# Altium project eBox_relay.PrjPcb
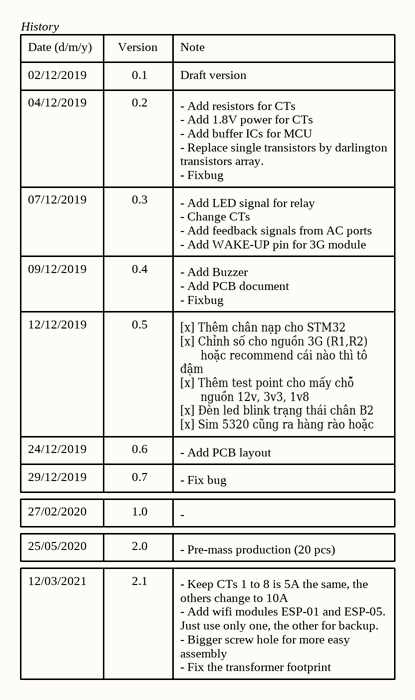
[diagram p0: eBox_Notes.SchDoc]
Hash: JD3SRPCM; Version: 3.0
2 sheets, 37 parts. Net scope: global (net labels, ports and power ports of the same name join across sheets).
Board file: eBox_relay.PcbDoc
Sheets:
  eBox_Notes.SchDoc
  eBox_relay.SchDoc

## Sheet eBox_Notes.SchDoc: eBox_Notes
size A4; DocumentNumber: 1; SheetNumber: 1; SheetTotal: 9

### Notes on the sheet
- History
- Date (d/m/y)
- 02/12/2019
- Version
- 0.1
- Note
- Draft version
- 04/12/2019
- 0.2
- 07/12/2019
- 0.3
- - Add resistors for CTs
  - Add 1.8V power for CTs
  - Add buffer ICs for MCU
  - Replace single transistors by darlington  transistors array.
  - Fixbug
- 09/12/2019
- 0.4
- - Add LED signal for relay
  - Change CTs
  - Add feedback signals from AC ports
  - Add WAKE-UP pin for 3G module
- 12/12/2019
- 0.5
- - Add Buzzer
  - Add PCB document
  - Fixbug
- [x] Thêm chân nạp cho STM32
  [x] Chỉnh số cho nguồn 3G (R1,R2)
  hoặc recommend cái nào thì tô đậm
  [x] Thêm test point cho mấy chỗ
  nguồn 12v, 3v3, 1v8
  [x] Đèn led blink trạng thái chân B2
  [x] Sim 5320 cũng ra hàng rào hoặc
  test point uart để test
- 24/12/2019
- 29/12/2019
- 0.6
- 0.7
- - Add PCB layout
- - Fix bug
- 27/02/2020
- 25/05/2020
- 1.0
- 2.0
- -
- - Pre-mass production (20 pcs)
- 12/03/2021
- 2.1
- - Keep CTs 1 to 8 is 5A the same, the others change to 10A
  - Add wifi modules ESP-01 and ESP-05. Just use only one, the other for backup.
  - Bigger screw hole for more easy assembly
  - Fix the transformer footprint
  - Use 5V power supply for the temperature sensor
- Title
- Size:
- Date:
- A4
- Number:
- Time:
- Revision:
- Sheet
- of
- NPN
- Lab
- File:

## Sheet eBox_relay.SchDoc: eBox_Peripherals
size A4; DocumentNumber: 4; SheetNumber: 4; SheetTotal: 9
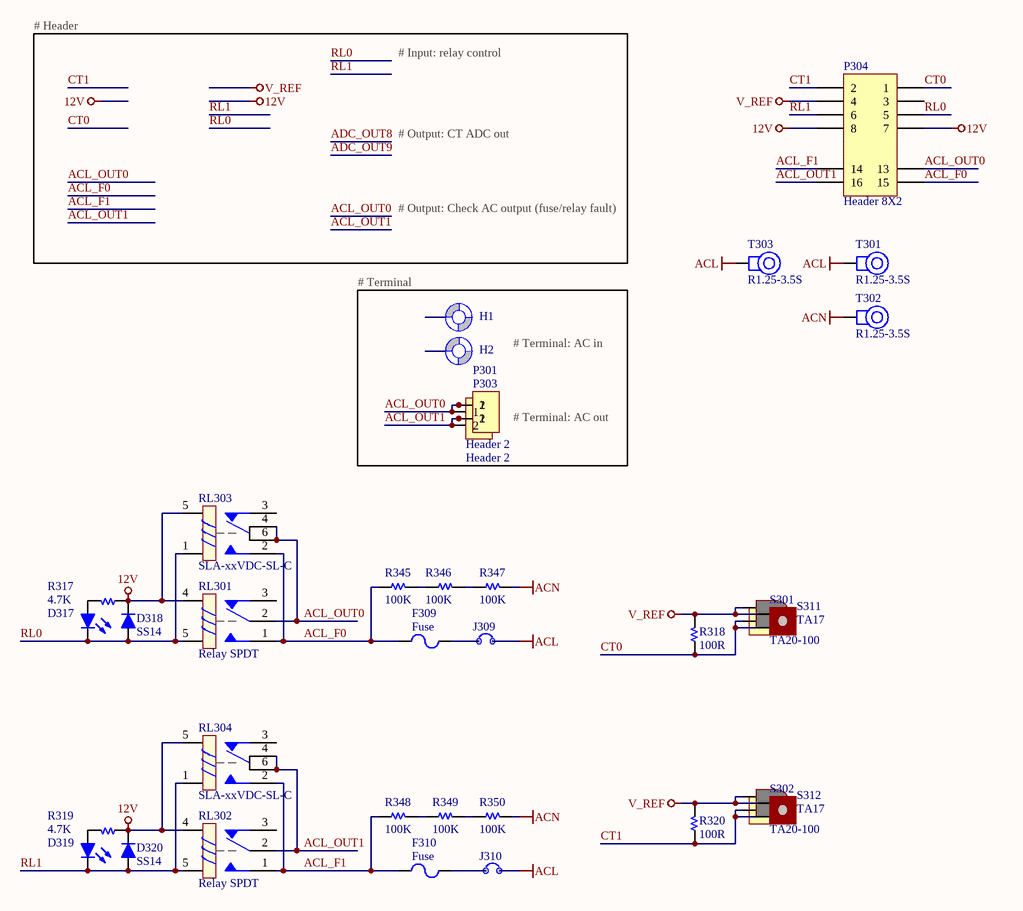
[diagram p1: eBox_relay.SchDoc]

### Parts
D317  Led  [LED 3MM - green]  (value not drawn)
D318  SS14  [DO-214AC (SMA) L]
D319  Led  [LED 3MM - green]  (value not drawn)
D320  SS14  [DO-214AC (SMA) L]
F309  Fuse  [FUSE 2 DIP 0520 BOX]
F310  Fuse  [FUSE 2 DIP 0520 BOX]
H1  Screw Hole  [SCREW/3.2/7.0/M]  (value not drawn)  (no BOM)
H2  Screw Hole  [SCREW/3.2/7.0/M]  (value not drawn)  (no BOM)
J309  JUMP 2 CUSTOM  [JUMP/2/Custom]  (value not drawn)  (no BOM)
J310  JUMP 2 CUSTOM  [JUMP/2/Custom]  (value not drawn)  (no BOM)
P301  Header 2  [HDR/Terminal/2/KF1000]  (no BOM)
P303  Header 2  [HDR/Terminal/2/KF55C-10]
P304  Header 8X2  [HDR/Header/16/DL/EDGE]
P305  Header 2  [HDR/Terminal/2/KF1000]  (value not drawn)  (no BOM)
R317  4.7K  [R 0603]
R318  100R  [R 0805]
R319  4.7K  [R 0603]
R320  100R  [R 0805]
R345  100K  [R 1206]
R346  100K  [R 1206]
R347  100K  [R 1206]
R348  100K  [R 1206]
R349  100K  [R 1206]
R350  100K  [R 1206]
RL301  Relay SPDT  [RL_SPDT_MIX]
RL302  Relay SPDT  [RL_SPDT_MIX]
RL303  SLA-xxVDC-SL-C  [RL_SPDT_30A]
RL304  SLA-xxVDC-SL-C  [RL_SPDT_30A]
S301  TA20-100  [TA20-100]
S302  TA20-100  [TA20-100]
S309  TA12-200  [TA12]  (value not drawn)
S310  NA  [TA12]  (value not drawn)
S311  TA17  [TA17]
S312  TA17  [TA17]
T301  R1.25-3.5S  [R1.25-3.5S]
T302  R1.25-3.5S  [R1.25-3.5S]
T303  R1.25-3.5S  [R1.25-3.5S]

### Nets
12V: D318.2(K) D320.2(K) P304.7 P304.8 R317.1 R319.1 RL301.4(COIL1) RL302.4(COIL1) RL303.5(COIL2) RL304.5(COIL2)
ACL: J309.2 J310.2 T301.1 T303.1
ACN: R347.2 R350.2 T302.1
V_REF: P304.4 R318.2 R320.2 S301.3 S302.3 S309.1 S310.1 S311.1 S312.1
ACL_F0: F309.1 P304.15 R345.1 RL301.1(COM) RL303.2(NO)
ACL_F1: F310.1 P304.14 R348.1 RL302.1(COM) RL304.2(NO)
ACL_OUT0: P301.1 P303.1 P304.13 P305.2 RL301.2(NO) RL303.4(COM) RL303.6(COM)
ACL_OUT1: P301.2 P303.2 P304.16 P305.1 RL302.2(NO) RL304.4(COM) RL304.6(COM)
CT0: P304.1 R318.1 S301.4 S309.2 S311.2
CT1: P304.2 R320.1 S302.4 S310.2 S312.2
RL0: D317.2(K) D318.1(A) P304.5 RL301.5(COIL2) RL303.1(COIL1)
RL1: D319.2(K) D320.1(A) P304.6 RL302.5(COIL2) RL304.1(COIL1)
NetD317_1: D317.1(A) R317.2
NetD319_1: D319.1(A) R319.2
NetF309_2: F309.2 J309.1
NetF310_2: F310.2 J310.1
NetR345_2: R345.2 R346.1
NetR346_2: R346.2 R347.1
NetR348_2: R348.2 R349.1
NetR349_2: R349.2 R350.1

Not connected (* = marked no-connect by the designer): H1 1(Screw); H2 1(Screw); P304 3 9 10 11 12; RL301 3(NC); RL302 3(NC); RL303 3(NC); RL304 3(NC)

### Notes on the sheet
- # Header
- # Input: relay control
- # Output: CT ADC out
- # Output: Check AC output (fuse/relay fault)
- (near H1) # Terminal
- # Terminal: AC in
- # Terminal: AC out
- Title
- Size:
- Date:
- A4
- Number:
- Time:
- Revision:
- Sheet
- of
- NPN
- Lab
- File:

### Library data of the parts
D317 D319 = Led: LED GREEN DIFFUSED 3MM ROUND T/H; TYPE: SMD; PACKAGE: SMD0805; STOCK CODE: HT17-2102SURC; SUPPLIER: tme.vn; STOCK DESC: SMD-0805 High Bright Red Chip LED; UNIT PRICE: 800
D318 D320 = Diode: DIODE SCHOTTKY 40V 1A SMA; BRAND: Toshiba; TYPE: SMD; PACKAGE: DO-214AC; PART NO: SS14; STOCK CODE: SS14; SUPPLIER: tme.vn; STOCK DESC: 1A 40V Schottky Barrier Diode; UNIT PRICE: 1000
P301 P303 P305 = Header 2: Header, 2-Pin
P304 = Header 8X2: Header, 8-Pin, Dual row
R317 R319 = Resistor: RES SMD 4.7K OHM 1% 1/10W 0805; PACKAGE: SMD0805; STOCK CODE: RM10JTN472; SUPPLIER: tme.vn; TYPE: SMD; STOCK DESC: 4.7K 5% SMD-0805 Resistor; UNIT PRICE: 60
R318 R320 = Resistor: RES SMD 100 OHM 1% 1/10W 0805; PACKAGE: SMD0805; STOCK CODE: RM10JTN681; SUPPLIER: tme.vn; TYPE: SMD; STOCK DESC: 680R 5% SMD-0805 Resistor; UNIT PRICE: 60
R345-R350 = Resistor: RES SMD 10K OHM 5% 1/4W 1206; PACKAGE: SMD1206; SUPPLIER: banlinhkien.com; TYPE: SMD; STOCK DESC: RES SMD 10K OHM 5% 1/4W 1206; UNIT PRICE: 240
RL303 RL304 = Relay SPDT_SLA
S309 = TA12: CURR SENSE 1:2000 5A T/H; BRAND: YHDC; PART NO: TA12-200; SUPPLIER: CHINA; TYPE: TH; UNIT PRICE: 22328
S310 = TA12: CURR SENSE 1:2000 5A T/H; PART NO: TA12-200; BRAND: YHDC; SUPPLIER: CHINA; TYPE: TH; UNIT PRICE: 22328
F309 F310 = Fuse: UNIT PRICE: 0
H1 H2 = Screw Hole: TYPE: NO-BOM; UNIT PRICE: 0
J309 J310 = JUMP 2 CUSTOM: TYPE: NO-BOM; UNIT PRICE: 0